# EasyEDA Pro project Q1_STM32_Minimum_System.epro

# Schematic 111
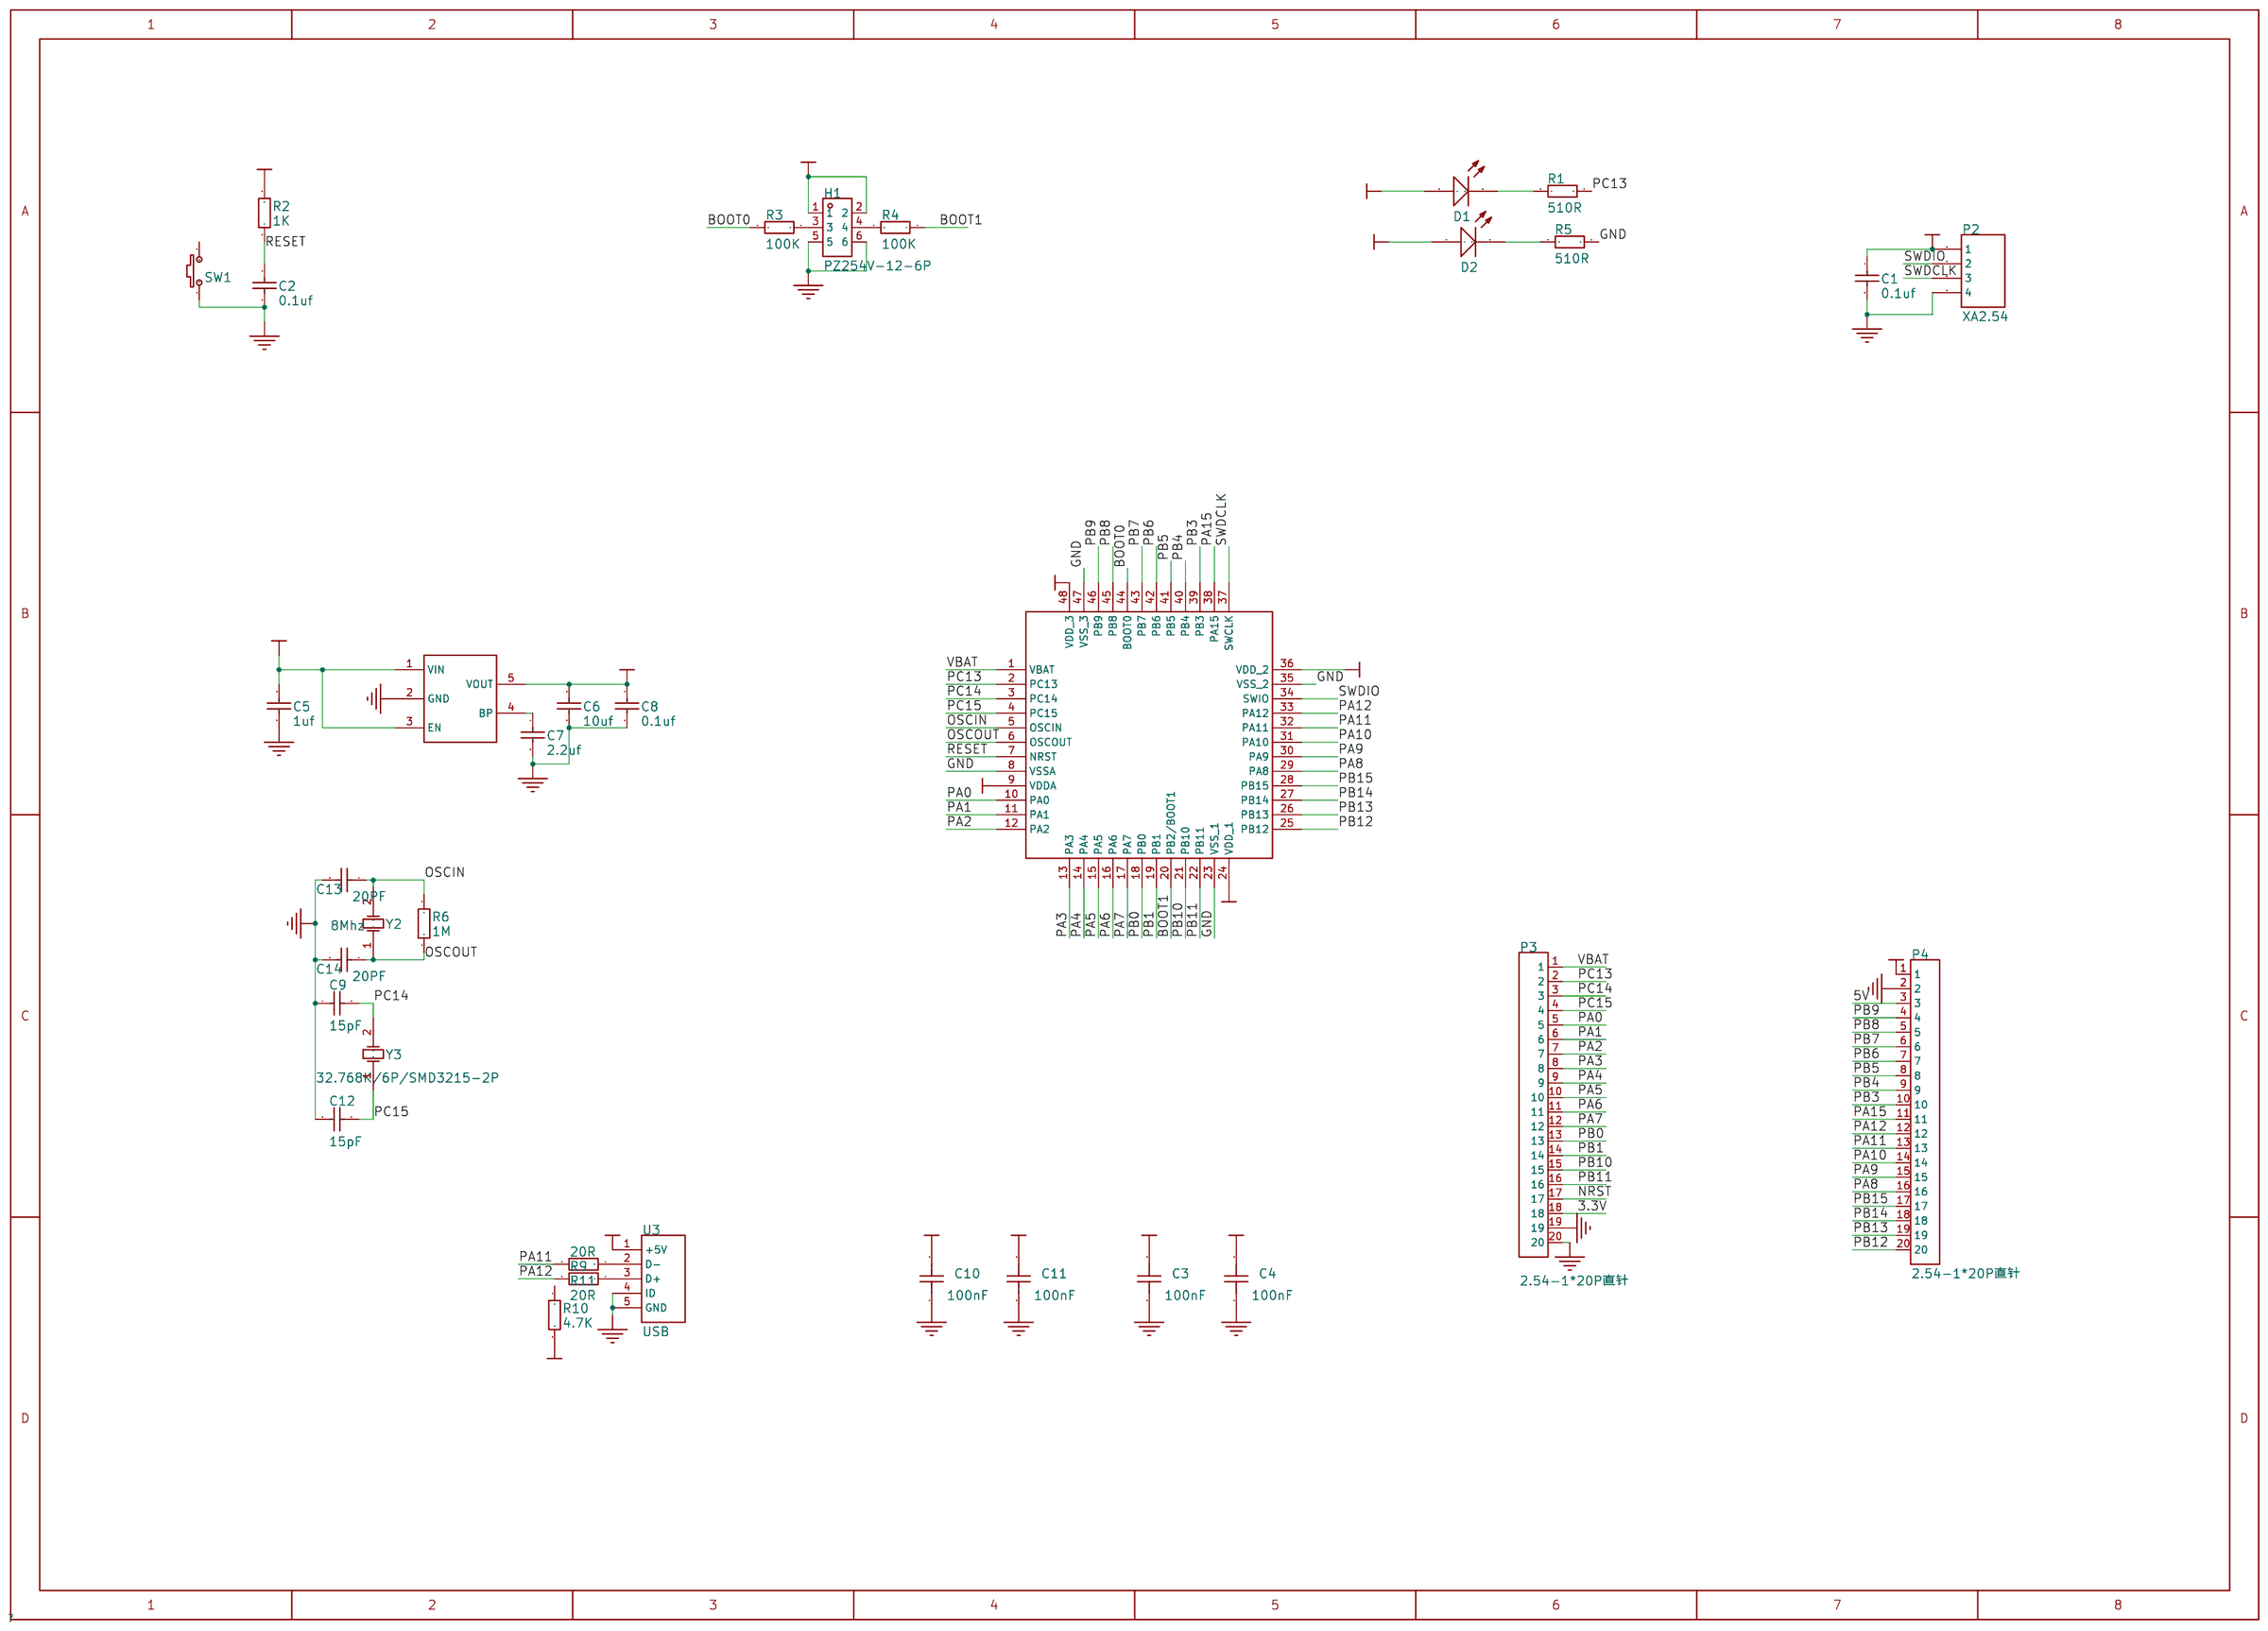
[diagram p0: schematic sheet]

## Parts
C1  0.1uf  [C0603_L]
C2  0.1uf  [C0603_L]
C3  100nF  [0805]
C4  100nF  [0805]
C5  1uf  [C0603_L]
C6  10uf  [C0603_L]
C7  2.2uf  [C0603_L]
C8  0.1uf  [C0603_L]
C9  15pF  [C0603_L]
C10  100nF  [0805]
C11  100nF  [0805]
C12  15pF  [C0603_L]
C13  20PF  [C0805_L]
C14  20PF  [C0805_L]
D1  LED  [LED0805_R]
D2  LED  [LED0805_R]
H1  PZ254V-12-6P  [IDC2.54-LI-2x3P]
P2  XA2.54  [HDR1X4]
P3  2.54-1*20P直针  [IDC20]
P4  2.54-1*20P直针  [IDC20]
R1  510R  [R0603_L]
R2  1K  [R0603_L]
R3  100K  [0805]
R4  100K  [0805]
R5  510R  [R0603_L]
R6  1M  [R0603_L]
R9  20R  [R0603_L]
R10  4.7K  [R0603_L]
R11  20R  [R0603_L]
SW1  3x6x5  [SW SMD-3*6*2.5]
U1  RT9193-33GB  [SOT-23-5]
U3  USB  [USB-MICRO_A]
U?#1  STM32F103C8T6  [LQFP-48_L7.0-W7.0-P0.50-LS9.0-BL]
Y2  8Mhz  [OSC HC-49S]
Y3  32.768K/6P/SMD3215-2P  [OSC HC-49S]

## Library data of the parts
C1 C2 C8 = 0.1uf: 贴片电容; BOM名称: 无极性贴片电容; 联系卖家，免费查找封装: 唯一出售店铺网址https://shop463601444.taobao.com; 封装库来自淘宝卖家ID：黄晶宝石: 其他店铺购入均为盗版假冒封装库，请立即申请退款; Origin 3D Model Title: C 0603; DesignItemID: C; LibraryName: 0.1 - 电阻-电容-电感-电位器
C3 C4 C10 C11 = 100nF: LCSC Part Name: 100nF ±10% 50V; Supplier Part: C6119867; Manufacturer: HRE(芯声); Manufacturer Part: CGA0603X7R104K500JT; Supplier Footprint: 0603; JLCPCB Part Class: Extended Part; Datasheet: https://atta.szlcsc.com/upload/public/pdf/source/20250103/C44077DA9E7B3EFAE02F22B6D3D1CBC9.pdf; Supplier: LCSC; Tolerance: ±10%; Voltage Rating: 50V; Temperature Coefficient: X7R; DesignItemID: CGA0603X7R104K500JT
C5 = 1uf: 贴片电容; BOM名称: 无极性贴片电容; 联系卖家，免费查找封装: 唯一出售店铺网址https://shop463601444.taobao.com; 封装库来自淘宝卖家ID：黄晶宝石: 其他店铺购入均为盗版假冒封装库，请立即申请退款; Origin 3D Model Title: C 0603; DesignItemID: C; LibraryName: 0.1 - 电阻-电容-电感-电位器
C6 = 10uf: 贴片电容; BOM名称: 无极性贴片电容; 联系卖家，免费查找封装: 唯一出售店铺网址https://shop463601444.taobao.com; 封装库来自淘宝卖家ID：黄晶宝石: 其他店铺购入均为盗版假冒封装库，请立即申请退款; Origin 3D Model Title: C 0603; DesignItemID: C; LibraryName: 0.1 - 电阻-电容-电感-电位器
C7 = 2.2uf: 贴片电容; BOM名称: 无极性贴片电容; 联系卖家，免费查找封装: 唯一出售店铺网址https://shop463601444.taobao.com; 封装库来自淘宝卖家ID：黄晶宝石: 其他店铺购入均为盗版假冒封装库，请立即申请退款; Origin 3D Model Title: C 0603; DesignItemID: C; LibraryName: 0.1 - 电阻-电容-电感-电位器
C9 C12 = 15pF: 贴片电容; BOM名称: 无极性贴片电容; 联系卖家，免费查找封装: 唯一出售店铺网址https://shop463601444.taobao.com; 封装库来自淘宝卖家ID：黄晶宝石: 其他店铺购入均为盗版假冒封装库，请立即申请退款; Origin 3D Model Title: C 0603; DesignItemID: C; LibraryName: 0.1 - 电阻-电容-电感-电位器
C13 C14 = 20PF: 0805贴片电容; BOM名称: 无极性贴片电容; 联系卖家，免费查找封装: 唯一出售店铺网址https://shop463601444.taobao.com; 封装库来自淘宝卖家ID：黄晶宝石: 其他店铺购入均为盗版假冒封装库，请立即申请退款; Origin 3D Model Title: C 0805; DesignItemID: C; LibraryName: 0.1 - 电阻-电容-电感-电位器
D1 D2 = LED: 发光二极管; 封装库来自淘宝卖家 ID：黄晶宝石: 其他店铺购入均为假冒，请立即申请退款，本店奖励现金5~20元; Origin 3D Model Title: LED_0805-R; LibraryName: 0.3 - LED发光二极管
H1 = PZ254V-12-6P: LCSC Part Name: 间距:2.54mm 2x3P 直插 方针; Supplier Part: C492420; Manufacturer: XFCN(兴飞); Supplier Footprint: 插件,P=2.54mm; JLCPCB Part Class: 扩展库; Datasheet: https://atta.szlcsc.com/upload/public/pdf/source/20200309/C492420_BAECB307B001054C09D200388220EAE6.pdf; Supplier: LCSC; Pin Structure: 2x3P; Pitch: 2.54mm; Row Spacing: 2.54mm; Circluar Pins/Square Pins: 方针; Mounting Type: 直插; Number of Rows: 双排; Number of Pins: 6P; Length of Mating Pin: 6mm; Insulation Height: 2.5mm; Length of End Connection Pin: 3mm; Contact Material: 黄铜; Operating Temperature Range: -40℃~+105℃; Color: 黑色; Origin 3D Model Title: IDC2.54-6P
P2 = XA2.54: Header, 4-Pin; LatestRevisionDate: 17-Jul-2002; LatestRevisionNote: Re-released for DXP Platform.; Publisher: Altium Limited; DesignItemID: Header 4; LibraryName: Miscellaneous Connectors
P3 P4 = 2.54-1*20P直针: LCSC Part Name: 1x20P 间距:2.54mm 方针 直插; Supplier Part: C50981; Manufacturer: BOOMELE(博穆精密); Supplier Footprint: 插件,P=2.54mm; JLCPCB Part Class: 扩展库; Datasheet: https://atta.szlcsc.com/upload/public/pdf/source/20151109/1457707572883.pdf; Supplier: LCSC; Pin Structure: 1x20P; Pitch: 2.54mm; Circluar Pins/Square Pins: 方针; Mounting Type: 直插; Number of Rows: 单排; Number of Pins: 20P; Current Rating: 3A; Contact Material: 黄铜; Operating Temperature: -40℃~+105℃; Color: 黑色; Origin 3D Model Title: SW3dPS-BH-20
R1 R5 = 510R: 贴片电阻; BOM名称: 贴片电阻; 联系卖家，免费查找封装: 唯一出售店铺网址https://shop463601444.taobao.com; 封装库来自淘宝卖家ID：黄晶宝石: 其他店铺购入均为盗版假冒封装库，请立即申请退款; Origin 3D Model Title: R0603; DesignItemID: R; LibraryName: 0.1 - 电阻-电容-电感-电位器
R2 = 1K: 贴片电阻; BOM名称: 贴片电阻; 联系卖家，免费查找封装: 唯一出售店铺网址https://shop463601444.taobao.com; 封装库来自淘宝卖家ID：黄晶宝石: 其他店铺购入均为盗版假冒封装库，请立即申请退款; Origin 3D Model Title: R0603; DesignItemID: R; LibraryName: 0.1 - 电阻-电容-电感-电位器
R3 R4 = 100K: Supplier Footprint: 0603; DesignItemID: Res_0603
R6 = 1M: 贴片电阻; BOM名称: 贴片电阻; 联系卖家，免费查找封装: 唯一出售店铺网址https://shop463601444.taobao.com; 封装库来自淘宝卖家ID：黄晶宝石: 其他店铺购入均为盗版假冒封装库，请立即申请退款; Origin 3D Model Title: R0603; DesignItemID: R; LibraryName: 0.1 - 电阻-电容-电感-电位器
R9 R11 = 20R: 贴片电阻; BOM名称: 贴片电阻; 联系卖家，免费查找封装: 唯一出售店铺网址https://shop463601444.taobao.com; 封装库来自淘宝卖家ID：黄晶宝石: 其他店铺购入均为盗版假冒封装库，请立即申请退款; Origin 3D Model Title: R0603; DesignItemID: R; LibraryName: Keypad
R10 = 4.7K: 贴片电阻; BOM名称: 贴片电阻; 联系卖家，免费查找封装: 唯一出售店铺网址https://shop463601444.taobao.com; 封装库来自淘宝卖家ID：黄晶宝石: 其他店铺购入均为盗版假冒封装库，请立即申请退款; Origin 3D Model Title: R0603; DesignItemID: R; LibraryName: Keypad
SW1 = 3x6x5: 3x6轻触开关; BOM名称: 3x6轻触开关; 联系卖家，免费查找封装: 唯一出售店铺网址https://shop463601444.taobao.com; OriginFootprint 2: SW DIP-3*6*4.3; OriginFootprint 3: SW DIP-3*6*4.3_V; OriginFootprint 4: SW DIP-3*6*5; OriginFootprint 5: SW SMD-3*6*4.3; OriginFootprint 6: SW SMD-3*6*5; OriginFootprint 7: SW 3*6*4.3-S-W; Origin 3D Model Title: TSW_SMD-3x6x2.5; DesignItemID: TSW 3x6; LibraryName: 0.7 - 常用按键-开关-蜂鸣器-电池-测试点
U1 = RT9193-33GB: LCSC Part Name: 输入5.5V 输出3.3V 300mA; Supplier Part: C15651; Manufacturer: RICHTEK(立锜); JLCPCB Part Class: Extended Part; Datasheet: https://atta.szlcsc.com/upload/public/pdf/source/20130730/1457706628575.pdf; Supplier: LCSC; Output Type: 固定; Maximum Input Voltage: 5.5V; Output Voltage: 3.3V; Output Current: 300mA; Power Supply Rejection Ratio (PSRR): 70dB@(100Hz)；50dB@(10kHz); Dropout Voltage: 300mV@(300mA); standby current: 130uA; Feature: 防静电保护；低ESR；热保护(TSD)；过流保护(OCP)；带使能; Operating Temperature: -40℃~+125℃; Output Polarity: 正极; Number of Outputs: 1; Origin 3D Model Title: SOT23-5-2
U3 = USB: 微型USB母座; BOM名称: 微型USB母座; 联系卖家，免费技术支持: 唯一出售店铺网址https://shop463601444.taobao.com; OriginFootprint 2: USB-MINI-A; OriginFootprint 3: USB-MICRO_C; OriginFootprint 4: USB-MICRO_D; OriginFootprint 5: USB-MICRO_E; Origin 3D Model Title: USB_MICRO_a; DesignItemID: USB-5P; LibraryName: 0.8 - 以太网-音频-Type-C USB插座
U?#1 = STM32F103C8T6: LCSC Part Name: 主流增强型ARM Cortex-M3 MCU，具有64 KB Flash、72 MHz CPU、电机控制、USB和CAN; Supplier Part: C8734; Manufacturer: ST(意法半导体); Supplier Footprint: LQFP-48(7x7); JLCPCB Part Class: Extended Part; Datasheet: https://item.szlcsc.com/datasheet/STM32F103C8T6/9243.html; Supplier: LCSC; CPU Core: ARM-M3; CPU Maximum Speed: 72MHz; Program Storage Size: 64KB; Program Memory Type: FLASH; Number of I/O: 37; ADC (Bit): 12bit; Voltage - Supply: 2V~3.6V
Y2 = 8Mhz: Crystal Oscillator; Published: 8-Jun-2000; LatestRevisionDate: 17-Jul-2002; LatestRevisionNote: Re-released for DXP Platform.; PackageReference: R38; Publisher: Altium Limited; PackageDescription: Crystal, Thru-Hole; 2 Leads; Body 3.1 x 8.2 mm (Dia.xH); Origin 3D Model Title: HC-49S; DesignItemID: XTAL; LibraryName: Miscellaneous Devices
Y3 = 32.768K/6P/SMD3215-2P: Crystal Oscillator; Published: 8-Jun-2000; LatestRevisionDate: 17-Jul-2002; LatestRevisionNote: Re-released for DXP Platform.; PackageReference: R38; Publisher: Altium Limited; PackageDescription: Crystal, Thru-Hole; 2 Leads; Body 3.1 x 8.2 mm (Dia.xH); Origin 3D Model Title: HC-49S; DesignItemID: XTAL; LibraryName: Miscellaneous Devices

## Nets
3.3V: C1.1 C3.2 C4.2 C6.1 C8.1 C10.2 C11.2 D1.1(A) D2.1(A) H1.1 H1.2 P2.1 P3.18 P4.1 R2.2 U1.5(VOUT) U?#1.9(VDDA) U?#1.24(VDD_1) U?#1.36(VDD_2) U?#1.48(VDD_3)
5V: C5.1 P4.3 R10.2 U1.1(VIN) U1.3(EN) U3.1(+5V)
GND: C1.2 C2.2 C3.1 C4.1 C5.2 C6.2 C7.2 C8.2 C9.1 C10.1 C11.1 C12.1 C13.2 C14.2 H1.5 H1.6 P2.4 P3.19 P3.20 P4.2 R5.1 SW1.1 U1.2(GND) U3.4(ID) U3.5(GND) U?#1.8(VSSA) U?#1.23(VSS_1) U?#1.35(VSS_2) U?#1.47(VSS_3)
VBAT: P3.1 U?#1.1(VBAT)
BOOT0: R3.2 U?#1.44(BOOT0)
BOOT1: R4.1 U?#1.20(PB2/BOOT1)
NRST: P3.17
OSCIN: C13.1 R6.2 U?#1.5(OSCIN) Y2.2(OSC2)
OSCOUT: C14.1 R6.1 U?#1.6(OSCOUT) Y2.1(OSC1)
PA0: P3.5 U?#1.10(PA0)
PA1: P3.6 U?#1.11(PA1)
PA2: P3.7 U?#1.12(PA2)
PA3: P3.8 U?#1.13(PA3)
PA4: P3.9 U?#1.14(PA4)
PA5: P3.10 U?#1.15(PA5)
PA6: P3.11 U?#1.16(PA6)
PA7: P3.12 U?#1.17(PA7)
PA8: P4.16 U?#1.29(PA8)
PA9: P4.15 U?#1.30(PA9)
PA10: P4.14 U?#1.31(PA10)
PA11: P4.13 R9.2 U?#1.32(PA11)
PA12: P4.12 R10.1 R11.2 U?#1.33(PA12)
PA15: P4.11 U?#1.38(PA15)
PB0: P3.13 U?#1.18(PB0)
PB1: P3.14 U?#1.19(PB1)
PB3: P4.10 U?#1.39(PB3)
PB4: P4.9 U?#1.40(PB4)
PB5: P4.8 U?#1.41(PB5)
PB6: P4.7 U?#1.42(PB6)
PB7: P4.6 U?#1.43(PB7)
PB8: P4.5 U?#1.45(PB8)
PB9: P4.4 U?#1.46(PB9)
PB10: P3.15 U?#1.21(PB10)
PB11: P3.16 U?#1.22(PB11)
PB12: P4.20 U?#1.25(PB12)
PB13: P4.19 U?#1.26(PB13)
PB14: P4.18 U?#1.27(PB14)
PB15: P4.17 U?#1.28(PB15)
PC13: P3.2 R1.1 U?#1.2(PC13)
PC14: C9.2 P3.3 U?#1.3(PC14) Y3.2(OSC2)
PC15: C12.2 P3.4 U?#1.4(PC15) Y3.1(OSC1)
RESET: C2.1 R2.1 SW1.2 U?#1.7(NRST)
SWDCLK: P2.3 U?#1.37(SWCLK)
SWDIO: P2.2 U?#1.34(SWIO)
NetC7_1: C7.1 U1.4(BP)
NetD1_2: D1.2(K) R1.2
NetD2_2: D2.2(K) R5.2
NetH1_3: H1.3 R3.1
NetH1_4: H1.4 R4.2
NetR9_1: R9.1 U3.2(D-)
NetR11_1: R11.1 U3.3(D+)

# Board PCB2_1
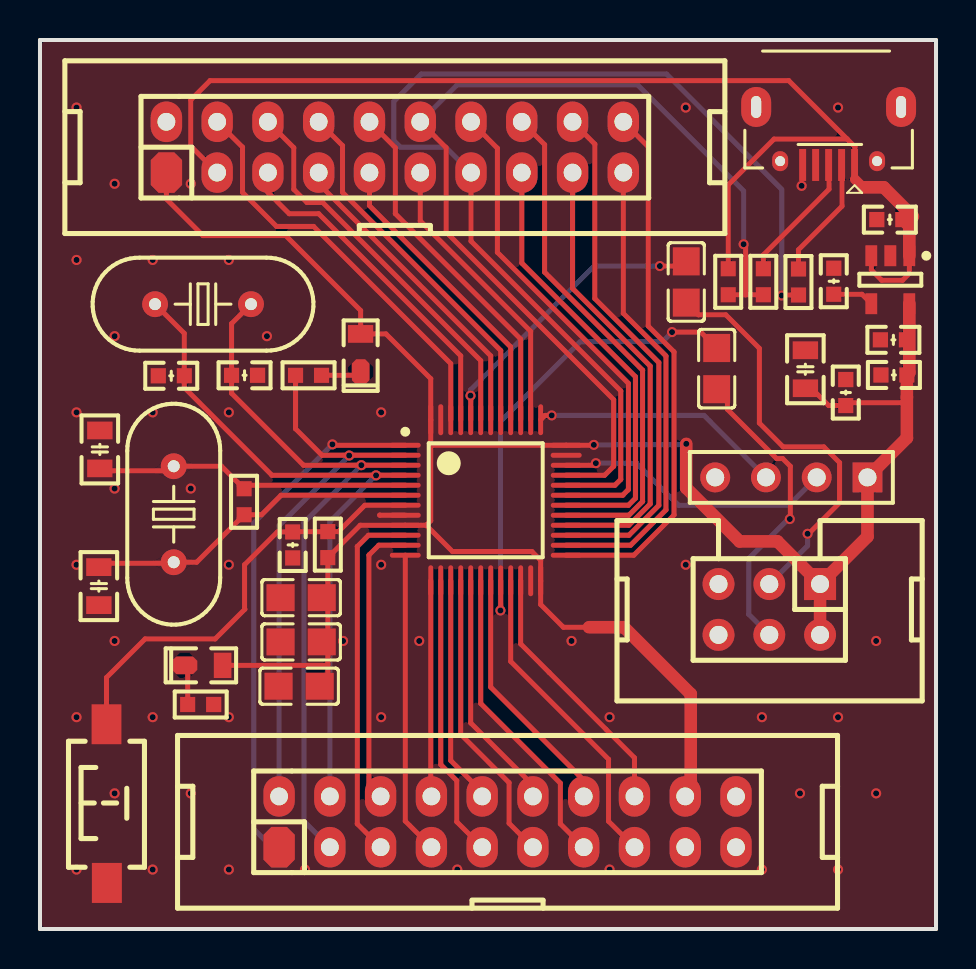
[diagram p1: board, top side]
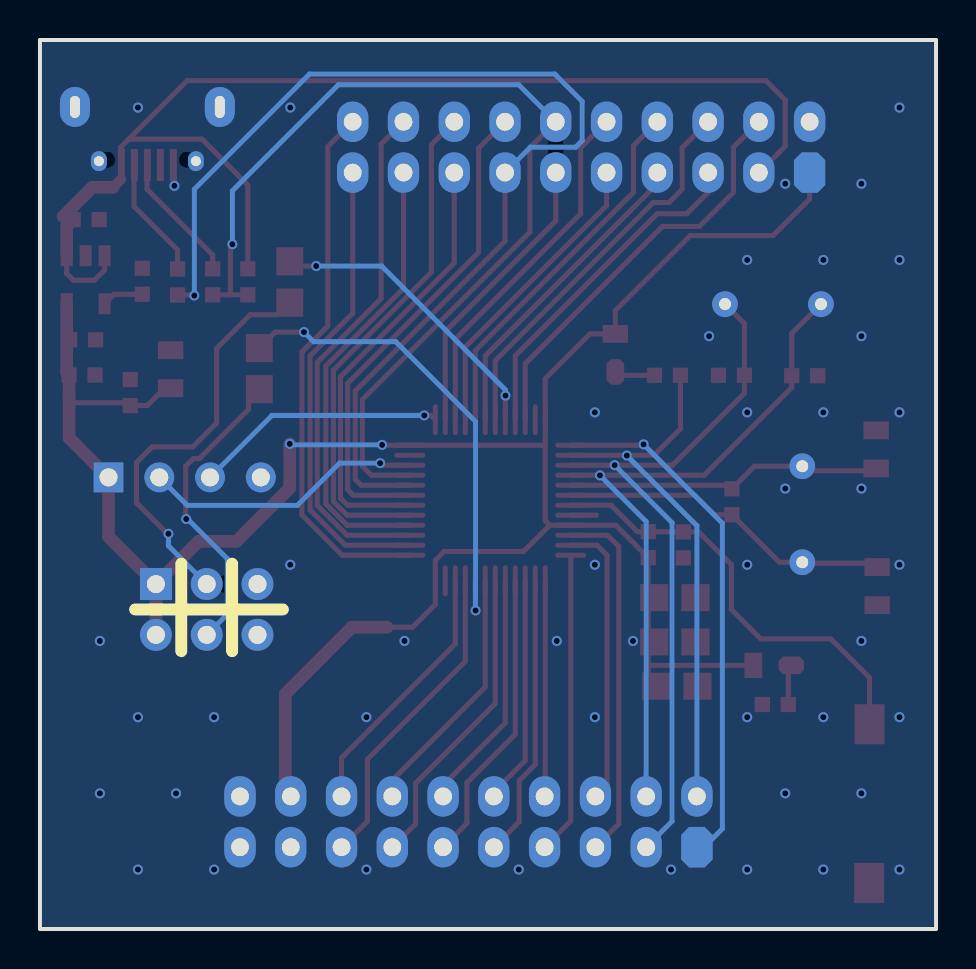
[diagram p2: board, bottom side, seen from below]

Outline 44.83 x 44.45 mm; copper layers: Top Layer, Mid-Layer 1, Internal Plane 1, Mid-Layer 2, Internal Plane 2, Mid-Layer 3, Internal Plane 3, Mid-Layer 4, Internal Plane 4, Mid-Layer 5, Internal Plane 5, Mid-Layer 6, Internal Plane 6, Mid-Layer 7, Internal Plane 7, Mid-Layer 8, Internal Plane 8, Mid-Layer 9, Internal Plane 9, Mid-Layer 10, Internal Plane 10, Mid-Layer 11, Internal Plane 11, Mid-Layer 12, Internal Plane 12, Mid-Layer 13, Internal Plane 13, Mid-Layer 14, Internal Plane 14, Mid-Layer 15, Internal Plane 15, Bottom Layer. Coordinates in mm from the lower left corner of the outline.
Outline path: 0,44.45 0,0 44.83,0 44.83,44.45 0,44.45
Stack: Top Layer 0.0356mm / Dielectric 1 0.32mm FR-4 er 4.8 / Bottom Layer 0.0356mm

## Design rules (mm)
spacing Clearance (default): track to track 0.102, other pairs 0.102 to 0.3
track width Width (default): min 0.102, default 0.254, max 1.524
differential pair DiffPairsRouting (default): width min 0.381, default 0.381, max 0.381; gap min 0.254, default 0.254

## Placement (name value [footprint] x y rotation side)
C1  0.1uf  [C0603_L]  40.32 26.82 90 top
C2  0.1uf  [C0603_L]  12.64 19.2 270 top
C3  100nF  [0805]  11.94 12.14 0 top
C4  100nF  [C0805_L]  38.29 27.99 270 top
C5  1uf  [C0603_L]  42.52 35.47 180 top
C6  10uf  [C0603_L]  42.7 29.46 180 top
C7  2.2uf  [C0603_L]  39.71 32.39 90 top
C8  0.1uf  [C0603_L]  42.72 27.7 180 top
C9  15pF  [C0603_L]  10.24 27.69 180 top
C10  100nF  [0805]  12.04 16.57 0 top
C11  100nF  [0805]  12.04 14.35 0 top
C12  15pF  [C0603_L]  6.57 27.66 0 top
C13  20PF  [C0805_L]  3 23.98 90 top
C14  20PF  [C0805_L]  2.95 17.15 270 top
D1  LED  [LED0805_R]  16.04 28.8 270 top
D2  LED  [LED0805_R]  8.19 13.18 180 top
H1  PZ254V-12-6P  [IDC2.54-LI-2x3P]  39.03 17.25 180 top
P2  XA2.54  [HDR1X4]  41.4 22.58 180 top
P3  2.54-1*20P直针  [IDC20]  11.96 4.09 0 top
P4  2.54-1*20P直针  [IDC20]  6.33 37.82 0 top
R1  510R  [R0603_L]  13.44 27.69 0 top
R2  1K  [R0603_L]  14.4 19.22 270 top
R3  100K  [0805]  32.33 31.32 90 top
R4  100K  [0805]  33.86 29.05 270 top
R5  510R  [R0603_L]  8.04 11.23 180 top
R6  1M  [R0603_L]  10.21 21.36 90 top
R9  20R  [R0603_L]  37.95 32.35 270 top
R10  4.7K  [R0603_L]  34.43 32.36 90 top
R11  20R  [R0603_L]  36.19 32.36 270 top
SW1  3x6x5  [SW SMD-3*6*2.5]  3.33 6.3 90 top
U1  RT9193-33GB  [SOT-23-5]  42.55 32.46 270 top
U2  STM32F103C8T6  [LQFP48_L]  22.3 21.44 0 top
U3  USB  [USB-MICRO_A]  39.46 41.1 180 top
Y2  8Mhz  [OSC HC-49S]  6.69 20.74 90 top
Y3  32.768K/6P/SMD3215-2P  [OSC HC-49S]  8.16 31.24 0 top

## Footprints (pads in the part's own frame, mm; a bottom-side part is the same pattern mirrored in y, then rotated)
0805
  rect 1.41x1.35 smd: 1(-0.001,0.001) 2(2.059,0.001)
C0603_L
  rect 0.762x0.762 smd: 1(-0.65,0) 2(0.65,0)
C0805_L
  rect 0.889x1.27 smd: 1(-0.95,0) 2(0.95,0)
HDR1X4
  rect 1.5x1.5 hole 0.9: 1(0,0)
  round 1.5 hole 0.9: 2(2.54,0) 3(5.08,0) 4(7.62,0)
IDC2.54-LI-2x3P
  rect 1.6x1.6 hole 0.9: 1(0,0)
  round 1.6 hole 0.9: 2(0,2.54) 3(2.54,0) 4(2.54,2.54) 5(5.08,0) 6(5.08,2.54)
IDC20
  custom 1.575x2.032 hole 0.889: 1(0,0)
  oval 1.575x2.032 hole 0.889: 2(0,2.54) 3(2.54,0) 4(2.54,2.54) 5(5.08,0) 6(5.08,2.54) 7(7.62,0) 8(7.62,2.54) 9(10.16,0) 10(10.16,2.54) 11(12.7,0) 12(12.7,2.54) 13(15.24,0) 14(15.24,2.54) 15(17.78,0) 16(17.78,2.54) 17(20.32,0) 18(20.32,2.54) 19(22.86,0) 20(22.86,2.54)
LED0805_R
  rect 0.889x1.27 smd: 1(-0.95,0)
  custom 1.27x0.889 smd: 2(0.95,0)
LQFP48_L
  oval 1.55x0.25 smd: 1(-4.025,2.75) 2(-4.025,2.25) 3(-4.025,1.75) 4(-4.025,1.25) 5(-4.025,0.75) 6(-4.025,0.25) 7(-4.025,-0.25) 8(-4.025,-0.75) 9(-4.025,-1.25) 10(-4.025,-1.75) 11(-4.025,-2.25) 12(-4.025,-2.75) 25(4.025,-2.75) 26(4.025,-2.25) 27(4.025,-1.75) 28(4.025,-1.25) 29(4.025,-0.75) 30(4.025,-0.25) 31(4.025,0.25) 32(4.025,0.75) 33(4.025,1.25) 34(4.025,1.75) 35(4.025,2.25) 36(4.025,2.75)
  oval 0.25x1.55 smd: 13(-2.75,-4.025) 14(-2.25,-4.025) 15(-1.75,-4.025) 16(-1.25,-4.025) 17(-0.75,-4.025) 18(-0.25,-4.025) 19(0.25,-4.025) 20(0.75,-4.025) 21(1.25,-4.025) 22(1.75,-4.025) 23(2.25,-4.025) 24(2.75,-4.025) 37(2.75,4.025) 38(2.25,4.025) 39(1.75,4.025) 40(1.25,4.025) 41(0.75,4.025) 42(0.25,4.025) 43(-0.25,4.025) 44(-0.75,4.025) 45(-1.25,4.025) 46(-1.75,4.025) 47(-2.25,4.025) 48(-2.75,4.025)
OSC HC-49S
  round 1.3 hole 0.6: 1(-2.4,0) 2(2.4,0)
R0603_L
  rect 0.762x0.762 smd: 1(-0.65,0) 2(0.65,0)
SOT-23-5
  rect 1.05x0.6 smd: 1(-1.2,0.95) 2(-1.2,0) 3(-1.2,-0.95) 4(1.2,-0.95) 5(1.2,0.95)
SW SMD-3*6*2.5
  rect 2x1.5 smd: 1(-3.996,-0.02) 2(3.937,0)
USB-MICRO_A
  rect 0.35x1.6 smd: 1(-1.3,2.9) 2(-0.65,2.9) 3(0,2.9) 4(0.65,2.9) 5(1.3,2.9)
  oval 1.5x2 hole 0.5x1.1: 5(-3.625,0) 5(3.625,0)
  oval 0.8x1 hole 0.5: 5(-2.425,2.71) 5(2.425,2.71)

## Nets
3.3V: C1.1 C3.2 C4.2 C6.1 C8.1 C10.2 C11.2 D1.1 D2.1 H1.1 H1.2 P2.1 P3.18 P4.1 R2.2 U1.5 U2.9 U2.24 U2.36 U2.48
5V: C5.1 P4.3 R10.2 U1.1 U1.3 U3.1
GND: C1.2 C2.2 C3.1 C4.1 C5.2 C6.2 C7.2 C8.2 C9.1 C10.1 C11.1 C12.1 C13.2 C14.2 H1.5 H1.6 P2.4 P3.19 P3.20 P4.2 R5.1 SW1.1 U1.2 U2.8 U2.23 U2.35 U2.47 U3.4 U3.5
VBAT: P3.1 U2.1
BOOT0: R3.2 U2.44
BOOT1: R4.1 U2.20
NetC7_1: C7.1 U1.4
NetD1_2: D1.2 R1.2
NetD2_2: D2.2 R5.2
NetH1_3: H1.3 R3.1
NetH1_4: H1.4 R4.2
NetR9_1: R9.1 U3.2
NetR11_1: R11.1 U3.3
NRST: P3.17
OSCIN: C13.1 R6.2 U2.5 Y2.2
OSCOUT: C14.1 R6.1 U2.6 Y2.1
PA0: P3.5 U2.10
PA1: P3.6 U2.11
PA2: P3.7 U2.12
PA3: P3.8 U2.13
PA4: P3.9 U2.14
PA5: P3.10 U2.15
PA6: P3.11 U2.16
PA7: P3.12 U2.17
PA8: P4.16 U2.29
PA9: P4.15 U2.30
PA10: P4.14 U2.31
PA11: P4.13 R9.2 U2.32
PA12: P4.12 R10.1 R11.2 U2.33
PA15: P4.11 U2.38
PB0: P3.13 U2.18
PB1: P3.14 U2.19
PB3: P4.10 U2.39
PB4: P4.9 U2.40
PB5: P4.8 U2.41
PB6: P4.7 U2.42
PB7: P4.6 U2.43
PB8: P4.5 U2.45
PB9: P4.4 U2.46
PB10: P3.15 U2.21
PB11: P3.16 U2.22
PB12: P4.20 U2.25
PB13: P4.19 U2.26
PB14: P4.18 U2.27
PB15: P4.17 U2.28
PC13: P3.2 R1.1 U2.2
PC14: C9.2 P3.3 U2.3 Y3.2
PC15: C12.2 P3.4 U2.4 Y3.1
RESET: C2.1 R2.1 SW1.2 U2.7
SWDCLK: P2.3 U2.37
SWDIO: P2.2 U2.34

## Via types
v1: diameter 0.508, hole 0.305, Top Layer to Bottom Layer, 61 vias

## Routing (per net, layer and track width the routed paths; a pad name or vN(x,y) marks a point on that pad's centre or on a via; arc(x,y) is an arc through that point)
3.3V: length 114.5
  Top Layer w0.254: C4.2 38.6,27.04 39.46,26.17 C1.1 ; 14.4,13.23 R2.2 16.02,20.19 U2.9 19.32,20.19 ; 14.4,13.23 14.35,13.18 D2.1 ; 14.4,13.23 14.4,12.55 C3.2 ; 19.55,24.11 19.55,20.42 19.32,20.19 ; 19.55,24.11 U2.48 19.55,27.52 17.31,29.75 D1.1 16.04,30.92 12.29,34.67 8.15,34.67 6.33,36.5 P4.1 ; 19.55,24.11 19.63,24.19 U2.36 27.65,24.19 ; 27.47,15.09 26.19,15.09 25.05,16.22 U2.24 25.05,18.43 24.61,18.87 20.64,18.87 19.32,20.19 ; 40.32,26.31 43.1,26.31 43.37,26.58
  Top Layer w0.635: 27.47,15.09 29.22,15.09 32.56,11.75 32.56,6.91 P3.18 ; 39.03,14.71 H1.1 ; H1.1 41.4,19.62 P2.1 43.37,24.55 C8.1 43.5,27.82 U1.5 ; H1.1 36.9,19.38 35,19.38 32.33,22.05 v1(32.33,24.26)
  Bottom Layer w0.254: v1(27.71,24.21) 32.13,24.21
5V: length 61.4
  Top Layer w0.254: U1.1 43.5,32.78 43.16,32.44 42.11,32.44 41.59,32.95 U1.3 ; P4.3 7.54,39.14 7.54,41.45 8.51,42.42 37.47,42.42 40.39,39.5 ; R10.2 34.43,37.2 36.73,39.5 40.39,39.5 ; 40.39,39.5 40.78,39.11 40.78,37.48
  Top Layer w0.508: 40.78,37.48 41.17,37.08
  Top Layer w0.635: C5.1 43.5,35.14 U1.1 ; 41.17,37.08 42.22,37.08 43.68,35.62
GND: length 1.3
  Top Layer w0.254: U2.8 17,20.69 16.99,20.7
  vias: v1(1.83,41.07) v1(1.83,33.45) v1(1.83,25.83) v1(1.83,18.21) v1(1.83,10.59) v1(1.83,2.97) v1(3.73,37.26) v1(3.73,29.64) v1(3.73,22.02) v1(3.73,14.4) v1(3.73,6.78) v1(5.64,33.45) v1(5.64,25.83) v1(5.64,10.59) v1(5.64,2.97) v1(7.54,37.26) v1(7.54,22.02) v1(7.54,6.78) v1(9.45,33.45) v1(9.45,25.83) v1(9.45,18.21) v1(9.45,10.59) v1(9.45,2.97) v1(11.35,29.64) v1(13.26,2.97) v1(15.16,14.4) v1(17.07,25.83) v1(17.07,18.21) v1(17.07,10.59) v1(18.97,14.4) v1(20.88,2.97) v1(26.59,14.4) v1(28.5,10.59) v1(28.5,2.97) v1(32.31,41.07) v1(32.31,18.21) v1(36.12,10.59) v1(36.12,2.97) v1(38.02,6.78) v1(38.11,37.16) v1(39.93,41.07) v1(39.93,10.59) v1(39.93,2.97) v1(41.83,14.4) v1(41.83,6.78)
VBAT: length 26.1
  Top Layer w0.254: 14.73,24.19 U2.1
  Bottom Layer w0.254: v1(14.63,24.23) 10.69,20.3 10.69,5 11.61,4.09 P3.1
BOOT0: length 14.8
  Top Layer w0.254: U2.44 21.55,26.56 ; v1(31.01,33.15) 32.1,33.15 R3.2
  Bottom Layer w0.254: v1(21.54,26.67) 21.54,26.95 27.74,33.15 v1(31.01,33.15)
BOOT1: length 23.8
  Top Layer w0.254: v1(31.62,29.84) 33.06,29.84 R4.1 ; 23.05,16.01 U2.20
  Bottom Layer w0.254: v1(23.04,15.93) 23.04,25.38 27.03,29.36 31.14,29.36 v1(31.62,29.84)
NetC7_1: length 2.1
  Top Layer w0.254: U1.4 41.12,31.74 C7.1
NetD1_2: length 2
  Top Layer w0.254: R1.2 15.88,27.69 D1.2
NetD2_2: length 2
  Top Layer w0.254: 7.39,11.23 7.39,13.03 D2.2
NetH1_3: length 20.7
  Top Layer w0.254: 38.46,19.76 40.01,21.31 40.01,23.32 39.22,24.11 37.19,24.11 35.99,25.3 35.99,29.03 34.32,30.71 32.95,30.71 R3.1
  Bottom Layer w0.254: H1.3 38.41,19.16 v1(38.41,19.76)
NetH1_4: length 15.4
  Top Layer w0.254: R4.2 34.39,26.45 34.39,25.98 36.86,23.52 37.16,23.52 37.54,23.14 37.54,20.45
  Bottom Layer w0.254: v1(37.52,20.5) 37.44,20.5 35.46,18.52 35.46,15.74 36.49,14.71
NetR9_1: length 5.9
  Top Layer w0.254: R9.1 37.95,33.96 40.13,36.14 40.13,37.97
NetR11_1: length 6.3
  Top Layer w0.254: 39.48,37.97 39.48,36.99 36.19,33.7 R11.1
OSCIN: length 15.8
  Top Layer w0.254: 3.16,22.91 6.46,22.91 Y2.2 9.08,23.14 R6.2 10.39,22.19 U2.5
OSCOUT: length 16.6
  Top Layer w0.254: 3.12,18.29 6.64,18.29 Y2.1 7.84,18.34 R6.1 11.09,20.71 12.06,21.69 U2.6
PA0: length 18.2
  Top Layer w0.254: U2.10 16.44,19.69 15.88,19.13 15.88,5.26 P3.5
PA1: length 14.3
  Top Layer w0.254: P3.6 16.46,7.21 16.46,18.69 16.95,19.19 U2.11
PA2: length 15.1
  Top Layer w0.254: U2.12 18.28,5.4 P3.7
PA3: length 10.8
  Top Layer w0.254: U2.13 19.55,6.66 P3.8
PA4: length 14.2
  Top Layer w0.254: P3.9 20.85,5.36 20.85,7.42 20.05,8.22 U2.14
PA5: length 11.4
  Top Layer w0.254: U2.15 20.55,8.43 22.12,6.85 P3.10
PA6: length 14.8
  Top Layer w0.254: U2.16 21.05,9.73 23.47,7.32 23.47,5.28 P3.11
PA7: length 12.1
  Top Layer w0.254: U2.17 21.55,10.3 24.66,7.19 P3.12
PA8: length 25.6
  Top Layer w0.254: P4.16 25.25,39.22 25.25,32.84 30.15,27.94 30.15,21.38 29.46,20.69 U2.29
PA9: length 22.3
  Top Layer w0.254: P4.15 24.11,33.3 29.79,27.61 29.79,21.54 29.44,21.19 U2.30
PA10: length 24.9
  Top Layer w0.254: P4.14 22.89,39.04 22.89,33.83 29.44,27.28 29.44,21.97 29.16,21.69 U2.31
PA11: length 56.2
  Top Layer w0.254: 37.21,31.7 R9.2 ; P4.13 21.56,34.39 29.06,26.9 29.06,22.48 28.77,22.19 U2.32
  Bottom Layer w0.254: v1(37.11,31.67) 37.11,36.98 31.34,42.75 19.08,42.75 17.7,41.38 17.7,39.42 18.03,39.09 20.3,39.09 P4.13
PA12: length 49.9
  Top Layer w0.254: R10.1 35.31,31.71 ; 35.31,31.71 R11.2 ; 35.31,31.71 35.31,34.14 v1(35.2,34.24) ; U2.33 28.25,22.69 28.7,23.14 28.7,26.47 20.32,34.85 20.32,39.07 P4.12
  Bottom Layer w0.254: v1(35.2,34.24) 35.2,36.91 29.9,42.22 20.88,42.22 P4.12
PA15: length 14.6
  Top Layer w0.254: U2.38 24.55,29.88 19.03,35.41 P4.11
PB0: length 15.5
  Top Layer w0.254: P3.13 26.03,5.26 26.03,7.29 22.05,11.27 U2.18
PB1: length 12.7
  Top Layer w0.254: U2.19 22.55,12.09 27.2,7.44 P3.14
PB3: length 18
  Top Layer w0.254: U2.39 24.05,29.49 17.78,35.76 17.78,39.07 P4.10
PB4: length 15.3
  Top Layer w0.254: P4.9 16.49,36.17 23.55,29.1 U2.40
PB5: length 18.7
  Top Layer w0.254: U2.41 23.05,28.92 15.14,36.83 15.14,39.17 P4.8
PB6: length 15.9
  Top Layer w0.254: P4.7 13.95,37.26 22.55,28.66 U2.42
PB7: length 19.8
  Top Layer w0.254: P4.6 12.7,39.07 12.7,36.98 13.36,36.32 14.15,36.32 22.05,28.42 U2.43
PB8: length 17.2
  Top Layer w0.254: U2.45 21.05,28.66 13.95,35.76 12.47,35.76 11.41,36.83 P4.5
PB9: length 20.8
  Top Layer w0.254: P4.4 10.14,39.09 10.14,36.83 11.84,35.13 13.69,35.13 20.55,28.27 U2.46
PB10: length 15.9
  Top Layer w0.254: P3.15 28.45,5.39 28.45,8.48 23.55,13.38 U2.21
PB11: length 13.1
  Top Layer w0.254: U2.22 24.05,14.25 29.74,8.56 P3.16
PB12: length 26.9
  Top Layer w0.254: P4.20 30.43,39.12 30.43,30.15 31.73,28.85 31.73,20.7 29.71,18.69 U2.25
PB13: length 23.5
  Top Layer w0.254: P4.19 29.19,30.79 31.32,28.65 31.32,20.95 29.55,19.19 U2.26
PB14: length 26.2
  Top Layer w0.254: P4.18 27.76,39.24 27.76,31.52 30.96,28.32 30.96,21.18 29.47,19.69 U2.27
PB15: length 22.8
  Top Layer w0.254: U2.28 29.46,20.19 30.53,21.26 30.53,28.14 26.65,32.03 P4.17
PC13: length 27.2
  Top Layer w0.254: U2.2 14.11,23.69 12.79,25.01 R1.1
  Bottom Layer w0.254: v1(15.47,23.67) 11.96,20.17 P3.2
PC14: length 35.9
  Top Layer w0.254: Y3.2 9.59,30.27 C9.2 9.59,26.79 13.19,23.19 U2.3
  Bottom Layer w0.254: v1(16.08,23.19) 13.21,20.32 13.21,5.39 P3.3
PC15: length 34.7
  Top Layer w0.254: U2.4 11.6,22.69 7.22,27.07 C12.2 7.22,29.78 Y3.1
  Bottom Layer w0.254: P3.4 14.5,20.37 v1(16.81,22.68)
RESET: length 21.6
  Top Layer w0.254: 12.93,19.86 14.1,19.86 ; SW1.2 3.33,12.57 5.26,14.5 8.77,14.5 10.25,15.99 10.24,16 10.24,18.21 11.88,19.85 C2.1 ; R2.1 14.94,19.87 16.26,21.19 U2.7
SWDCLK: length 12.7
  Top Layer w0.254: U2.37 25.27,25.68 v1(25.6,25.68)
  Bottom Layer w0.254: P2.3 33.22,25.68 v1(25.6,25.68) 25.55,25.68
SWDIO: length 14
  Top Layer w0.254: U2.34 27.71,23.19 v1(27.81,23.29)
  Bottom Layer w0.254: P2.2 37.47,21.18 31.95,21.18 29.84,23.29 v1(27.81,23.29)

## Copper pours and planes (outline as drawn; the poured copper is in the pictures)
GND on Top Layer: 0,44.45 44.83,44.45 44.83,0 0,0
GND on Bottom Layer: 0,44.45 44.83,44.45 44.83,0 0,0

Small or netless copper shapes (teardrops, artwork), in the pictures only: 81 on Top Layer, 9 on Bottom Layer
